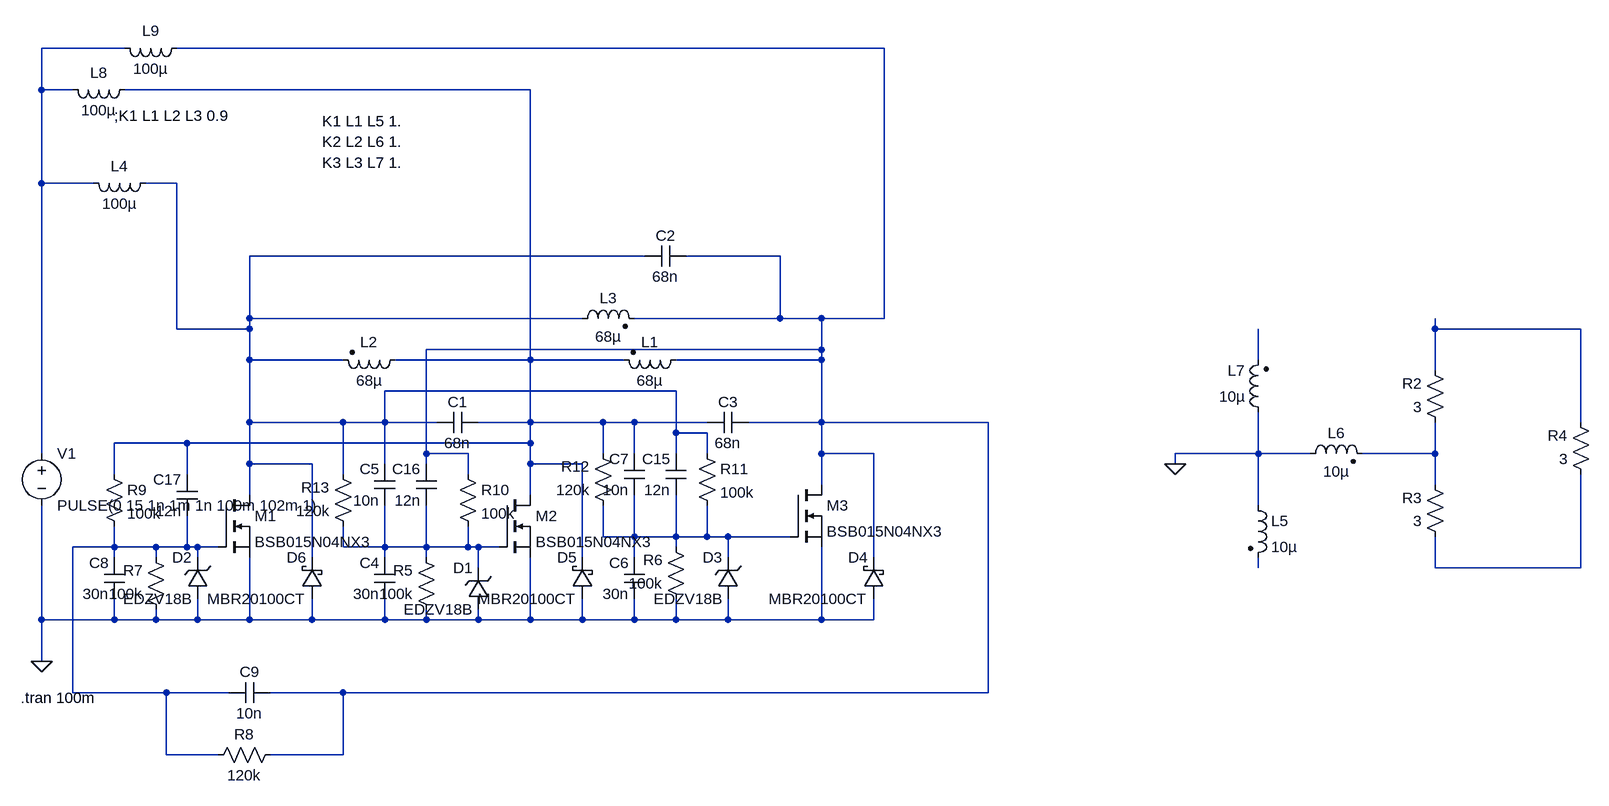
[diagram p0: schematic reso3phasetrianglecoils3.asc]
reso3phasetrianglecoils3.asc, the LTspice schematic file:
Version 4
SHEET 1 2452 680
WIRE 192 -656 64 -656
WIRE 1360 -656 272 -656
WIRE 64 -592 64 -656
WIRE 112 -592 64 -592
WIRE 816 -592 192 -592
WIRE 64 -448 64 -592
WIRE 144 -448 64 -448
WIRE 272 -448 224 -448
WIRE 992 -336 384 -336
WIRE 1200 -336 1056 -336
WIRE 384 -240 384 -336
WIRE 896 -240 384 -240
WIRE 1200 -240 1200 -336
WIRE 1200 -240 976 -240
WIRE 1264 -240 1200 -240
WIRE 1360 -240 1360 -656
WIRE 1360 -240 1264 -240
WIRE 272 -224 272 -448
WIRE 384 -224 384 -240
WIRE 384 -224 272 -224
WIRE 2208 -224 2208 -240
WIRE 2432 -224 2208 -224
WIRE 1264 -192 1264 -240
WIRE 1264 -192 656 -192
WIRE 384 -176 384 -224
WIRE 528 -176 384 -176
WIRE 816 -176 816 -592
WIRE 816 -176 608 -176
WIRE 960 -176 816 -176
WIRE 1264 -176 1264 -192
WIRE 1264 -176 1040 -176
WIRE 1936 -176 1936 -224
WIRE 2208 -160 2208 -224
WIRE 1040 -128 592 -128
WIRE 384 -80 384 -176
WIRE 528 -80 384 -80
WIRE 592 -80 592 -128
WIRE 592 -80 528 -80
WIRE 672 -80 592 -80
WIRE 816 -80 816 -176
WIRE 816 -80 736 -80
WIRE 928 -80 816 -80
WIRE 976 -80 928 -80
WIRE 1088 -80 976 -80
WIRE 1264 -80 1264 -176
WIRE 1264 -80 1152 -80
WIRE 1520 -80 1264 -80
WIRE 2432 -80 2432 -224
WIRE 1040 -64 1040 -128
WIRE 1088 -64 1040 -64
WIRE 288 -48 176 -48
WIRE 816 -48 816 -80
WIRE 816 -48 288 -48
WIRE 64 -32 64 -448
WIRE 656 -32 656 -192
WIRE 720 -32 656 -32
WIRE 928 -32 928 -80
WIRE 976 -32 976 -80
WIRE 1040 -32 1040 -64
WIRE 1088 -32 1088 -64
WIRE 1264 -32 1264 -80
WIRE 1344 -32 1264 -32
WIRE 1936 -32 1936 -96
WIRE 1936 -32 1808 -32
WIRE 2016 -32 1936 -32
WIRE 2208 -32 2208 -80
WIRE 2208 -32 2096 -32
WIRE 384 -16 384 -80
WIRE 480 -16 384 -16
WIRE 592 -16 592 -80
WIRE 656 -16 656 -32
WIRE 816 -16 816 -48
WIRE 896 -16 816 -16
WIRE 1808 -16 1808 -32
WIRE 176 0 176 -48
WIRE 288 0 288 -48
WIRE 528 0 528 -80
WIRE 720 0 720 -32
WIRE 1264 16 1264 -32
WIRE 2208 16 2208 -32
WIRE 384 32 384 -16
WIRE 816 32 816 -16
WIRE 1936 48 1936 -32
WIRE 928 96 928 48
WIRE 976 96 976 32
WIRE 976 96 928 96
WIRE 1040 96 1040 32
WIRE 1040 96 976 96
WIRE 1088 96 1088 48
WIRE 1088 96 1040 96
WIRE 1120 96 1088 96
WIRE 1216 96 1120 96
WIRE 176 112 176 80
WIRE 176 112 112 112
WIRE 240 112 176 112
WIRE 288 112 288 64
WIRE 288 112 240 112
WIRE 304 112 288 112
WIRE 336 112 304 112
WIRE 528 112 528 80
WIRE 592 112 592 48
WIRE 592 112 528 112
WIRE 656 112 656 48
WIRE 656 112 592 112
WIRE 720 112 720 80
WIRE 720 112 656 112
WIRE 736 112 720 112
WIRE 768 112 736 112
WIRE 1040 112 1040 96
WIRE 176 128 176 112
WIRE 240 128 240 112
WIRE 304 128 304 112
WIRE 480 128 480 -16
WIRE 592 128 592 112
WIRE 656 128 656 112
WIRE 896 128 896 -16
WIRE 976 128 976 96
WIRE 1120 128 1120 96
WIRE 1344 128 1344 -32
WIRE 736 144 736 112
WIRE 1936 144 1936 128
WIRE 2208 144 2208 96
WIRE 2432 144 2432 0
WIRE 2432 144 2208 144
WIRE 64 224 64 48
WIRE 176 224 176 192
WIRE 176 224 64 224
WIRE 240 224 240 208
WIRE 240 224 176 224
WIRE 304 224 304 192
WIRE 304 224 240 224
WIRE 384 224 384 128
WIRE 384 224 304 224
WIRE 480 224 480 192
WIRE 480 224 384 224
WIRE 592 224 592 192
WIRE 592 224 480 224
WIRE 656 224 656 208
WIRE 656 224 592 224
WIRE 736 224 736 208
WIRE 736 224 656 224
WIRE 816 224 816 128
WIRE 816 224 736 224
WIRE 896 224 896 192
WIRE 896 224 816 224
WIRE 976 224 976 192
WIRE 976 224 896 224
WIRE 1040 224 1040 192
WIRE 1040 224 976 224
WIRE 1120 224 1120 192
WIRE 1120 224 1040 224
WIRE 1264 224 1264 112
WIRE 1264 224 1120 224
WIRE 1344 224 1344 192
WIRE 1344 224 1264 224
WIRE 64 288 64 224
WIRE 112 336 112 112
WIRE 256 336 112 336
WIRE 352 336 256 336
WIRE 528 336 416 336
WIRE 1520 336 1520 -80
WIRE 1520 336 528 336
WIRE 256 432 256 336
WIRE 336 432 256 432
WIRE 528 432 528 336
WIRE 528 432 416 432
FLAG 64 288 0
FLAG 1808 -16 0
SYMBOL voltage 64 -48 R0
WINDOW 123 0 0 Left 2
WINDOW 39 0 0 Left 2
SYMATTR InstName V1
SYMATTR Value PULSE(0 15 1n 1m 1n 100m 102m 1)
SYMBOL nmos 336 32 R0
SYMATTR InstName M1
SYMATTR Value BSB015N04NX3
SYMBOL nmos 768 32 R0
SYMATTR InstName M2
SYMATTR Value BSB015N04NX3
SYMBOL nmos 1216 16 R0
SYMATTR InstName M3
SYMATTR Value BSB015N04NX3
SYMBOL ind2 1056 -192 R90
WINDOW 0 4 56 VBottom 2
WINDOW 3 32 56 VTop 2
SYMATTR InstName L1
SYMATTR Value 68µ
SYMATTR Type ind
SYMATTR SpiceLine Rser=0.001
SYMBOL ind2 624 -192 R90
WINDOW 0 4 56 VBottom 2
WINDOW 3 32 56 VTop 2
SYMATTR InstName L2
SYMATTR Value 68µ
SYMATTR Type ind
SYMATTR SpiceLine Rser=0.001
SYMBOL ind2 880 -224 R270
WINDOW 0 32 56 VTop 2
WINDOW 3 4 56 VBottom 2
SYMATTR InstName L3
SYMATTR Value 68µ
SYMATTR Type ind
SYMATTR SpiceLine Rser=0.001
SYMBOL cap 672 -64 R270
WINDOW 0 32 32 VTop 2
WINDOW 3 0 32 VBottom 2
SYMATTR InstName C1
SYMATTR Value 68n
SYMBOL cap 992 -320 R270
WINDOW 0 32 32 VTop 2
WINDOW 3 0 32 VBottom 2
SYMATTR InstName C2
SYMATTR Value 68n
SYMBOL cap 1088 -64 R270
WINDOW 0 32 32 VTop 2
WINDOW 3 0 32 VBottom 2
SYMATTR InstName C3
SYMATTR Value 68n
SYMBOL ind 240 -464 R90
WINDOW 0 5 56 VBottom 2
WINDOW 3 32 56 VTop 2
SYMATTR InstName L4
SYMATTR Value 100µ
SYMBOL ind2 1920 32 R0
SYMATTR InstName L5
SYMATTR Value 10µ
SYMATTR Type ind
SYMBOL ind2 2000 -16 R270
WINDOW 0 32 56 VTop 2
WINDOW 3 4 56 VBottom 2
SYMATTR InstName L6
SYMATTR Value 10µ
SYMATTR Type ind
SYMBOL ind2 1952 -80 R180
WINDOW 0 36 80 Left 2
WINDOW 3 36 40 Left 2
SYMATTR InstName L7
SYMATTR Value 10µ
SYMATTR Type ind
SYMBOL res 2224 -64 R180
WINDOW 0 36 76 Left 2
WINDOW 3 36 40 Left 2
SYMATTR InstName R2
SYMATTR Value 3
SYMBOL res 2224 112 R180
WINDOW 0 36 76 Left 2
WINDOW 3 36 40 Left 2
SYMATTR InstName R3
SYMATTR Value 3
SYMBOL res 2448 16 R180
WINDOW 0 36 76 Left 2
WINDOW 3 36 40 Left 2
SYMATTR InstName R4
SYMATTR Value 3
SYMBOL cap 608 192 R180
WINDOW 0 24 56 Left 2
WINDOW 3 24 8 Left 2
SYMATTR InstName C4
SYMATTR Value 30n
SYMBOL cap 608 48 R180
WINDOW 0 24 56 Left 2
WINDOW 3 24 8 Left 2
SYMATTR InstName C5
SYMATTR Value 10n
SYMBOL res 672 224 R180
WINDOW 0 36 76 Left 2
WINDOW 3 36 40 Left 2
SYMATTR InstName R5
SYMATTR Value 100k
SYMBOL cap 992 192 R180
WINDOW 0 24 56 Left 2
WINDOW 3 24 8 Left 2
SYMATTR InstName C6
SYMATTR Value 30n
SYMBOL cap 992 32 R180
WINDOW 0 24 56 Left 2
WINDOW 3 24 8 Left 2
SYMATTR InstName C7
SYMATTR Value 10n
SYMBOL res 1056 208 R180
WINDOW 0 36 76 Left 2
WINDOW 3 36 40 Left 2
SYMATTR InstName R6
SYMATTR Value 100k
SYMBOL cap 192 192 R180
WINDOW 0 24 56 Left 2
WINDOW 3 24 8 Left 2
SYMATTR InstName C8
SYMATTR Value 30n
SYMBOL cap 352 352 R270
WINDOW 0 32 32 VTop 2
WINDOW 3 0 32 VBottom 2
SYMATTR InstName C9
SYMATTR Value 10n
SYMBOL res 256 224 R180
WINDOW 0 36 76 Left 2
WINDOW 3 36 40 Left 2
SYMATTR InstName R7
SYMATTR Value 100k
SYMBOL zener 1136 192 R180
WINDOW 0 24 64 Left 2
WINDOW 3 24 0 Left 2
SYMATTR InstName D3
SYMATTR Value EDZV18B
SYMATTR Description Diode
SYMATTR Type diode
SYMBOL zener 752 208 R180
WINDOW 0 24 64 Left 2
WINDOW 3 24 0 Left 2
SYMATTR InstName D1
SYMATTR Value EDZV18B
SYMATTR Description Diode
SYMATTR Type diode
SYMBOL zener 320 192 R180
WINDOW 0 24 64 Left 2
WINDOW 3 24 0 Left 2
SYMATTR InstName D2
SYMATTR Value EDZV18B
SYMATTR Description Diode
SYMATTR Type diode
SYMBOL ind 208 -608 R90
WINDOW 0 5 56 VBottom 2
WINDOW 3 32 56 VTop 2
SYMATTR InstName L8
SYMATTR Value 100µ
SYMBOL ind 288 -672 R90
WINDOW 0 5 56 VBottom 2
WINDOW 3 32 56 VTop 2
SYMATTR InstName L9
SYMATTR Value 100µ
SYMBOL cap 1056 32 R180
WINDOW 0 24 56 Left 2
WINDOW 3 24 8 Left 2
SYMATTR InstName C15
SYMATTR Value 12n
SYMBOL cap 672 48 R180
WINDOW 0 24 56 Left 2
WINDOW 3 24 8 Left 2
SYMATTR InstName C16
SYMATTR Value 12n
SYMBOL cap 304 64 R180
WINDOW 0 24 56 Left 2
WINDOW 3 24 8 Left 2
SYMATTR InstName C17
SYMATTR Value 12n
SYMBOL res 320 448 R270
WINDOW 0 32 56 VTop 2
WINDOW 3 0 56 VBottom 2
SYMATTR InstName R8
SYMATTR Value 120k
SYMBOL res 160 -16 R0
SYMATTR InstName R9
SYMATTR Value 100k
SYMBOL res 704 -16 R0
SYMATTR InstName R10
SYMATTR Value 100k
SYMBOL res 1072 -48 R0
SYMATTR InstName R11
SYMATTR Value 100k
SYMBOL schottky 1360 192 R180
WINDOW 0 24 64 Left 2
WINDOW 3 24 0 Left 2
SYMATTR InstName D4
SYMATTR Value MBR20100CT
SYMATTR Description Diode
SYMATTR Type diode
SYMBOL schottky 912 192 R180
WINDOW 0 24 64 Left 2
WINDOW 3 24 0 Left 2
SYMATTR InstName D5
SYMATTR Value MBR20100CT
SYMATTR Description Diode
SYMATTR Type diode
SYMBOL schottky 496 192 R180
WINDOW 0 24 64 Left 2
WINDOW 3 24 0 Left 2
SYMATTR InstName D6
SYMATTR Value MBR20100CT
SYMATTR Description Diode
SYMATTR Type diode
SYMBOL res 944 64 R180
WINDOW 0 36 76 Left 2
WINDOW 3 36 40 Left 2
SYMATTR InstName R12
SYMATTR Value 120k
SYMBOL res 544 96 R180
WINDOW 0 36 76 Left 2
WINDOW 3 36 40 Left 2
SYMATTR InstName R13
SYMATTR Value 120k
TEXT 32 344 Left 2 !.tran 100m
TEXT 496 -544 Left 2 !K1 L1 L5 1.
TEXT 496 -512 Left 2 !K2 L2 L6 1.
TEXT 496 -480 Left 2 !K3 L3 L7 1.
TEXT 176 -552 Left 2 !;K1 L1 L2 L3 0.9

The netlist it stands for:
* reso3phasetrianglecoils3.asc
V1 N001 0 PULSE(0 15 1n 1m 1n 100m 102m 1)
M1 N004 N009 0 0 BSB015N04NX3
M2 N003 N010 0 0 BSB015N04NX3
M3 N002 N008 0 0 BSB015N04NX3
L1 N002 N003 68µ Rser=0.001
L2 N003 N004 68µ Rser=0.001
L3 N004 N002 68µ Rser=0.001
C1 N004 N003 68n
C2 N004 N002 68n
C3 N003 N002 68n
L4 N004 N001 100µ
L5 0 N011 10µ
L6 0 N007 10µ
L7 0 N006 10µ
R2 N007 N005 3
R3 N012 N007 3
R4 N012 N005 3
C4 0 N010 30n
C5 N010 N004 10n
R5 0 N010 100k
C6 0 N008 30n
C7 N008 N003 10n
R6 0 N008 100k
C8 0 N009 30n
C9 N009 N002 10n
R7 0 N009 100k
D3 0 N008 EDZV18B
D1 0 N010 EDZV18B
D2 0 N009 EDZV18B
L8 N003 N001 100µ
L9 N002 N001 100µ
C15 N008 N004 12n
C16 N010 N002 12n
C17 N009 N003 12n
R8 N009 N002 120k
R9 N003 N009 100k
R10 N002 N010 100k
R11 N004 N008 100k
D4 0 N002 MBR20100CT
D5 0 N003 MBR20100CT
D6 0 N004 MBR20100CT
R12 N008 N003 120k
R13 N010 N004 120k
.model D D
.lib standard.dio
.model NMOS NMOS
.model PMOS PMOS
.lib standard.mos
.tran 100m
K1 L1 L5 1.
K2 L2 L6 1.
K3 L3 L7 1.
;K1 L1 L2 L3 0.9
.backanno
.end